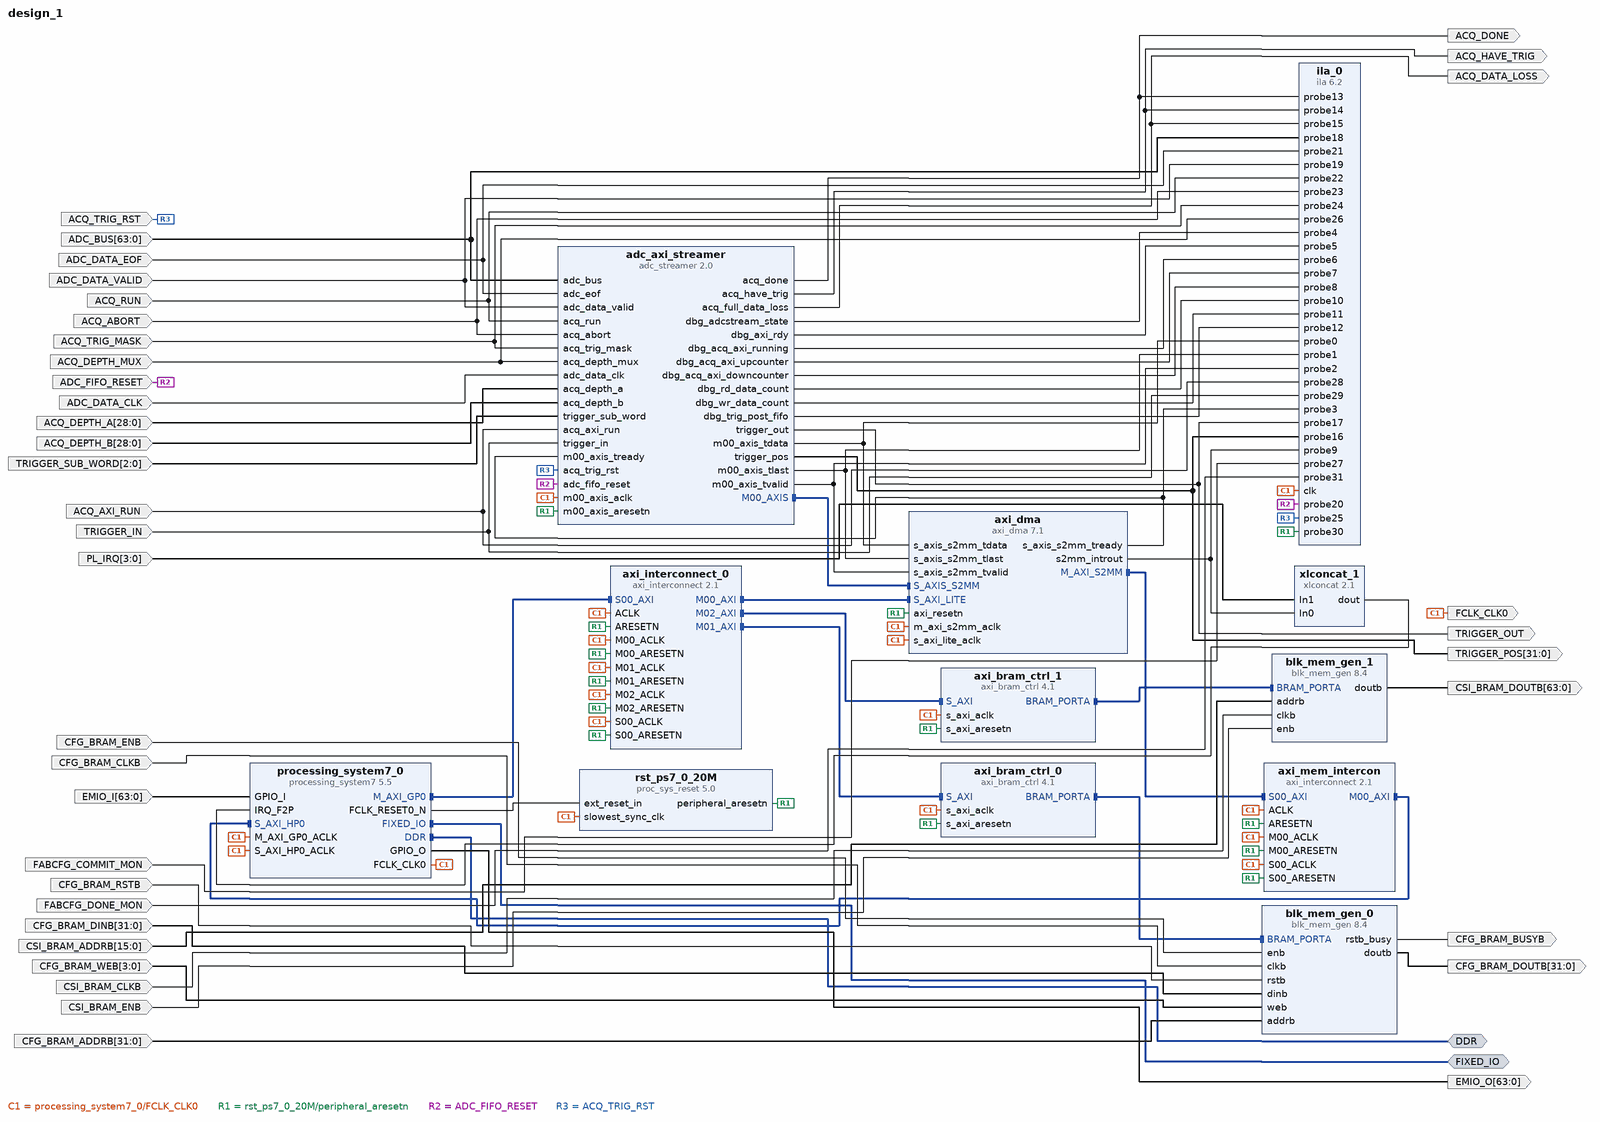
[diagram p0: block diagram of the top level]
# Vivado block design design_1, xc7z014sclg400-1, Vivado 2019.2
create_bd_design design_1

create_bd_intf_port -mode Master -vlnv xilinx.com:interface:ddrx_rtl:1.0 DDR
create_bd_intf_port -mode Master -vlnv xilinx.com:display_processing_system7:fixedio_rtl:1.0 FIXED_IO
create_bd_port -dir O -type clk FCLK_CLK0
create_bd_port -dir I -from 63 -to 0 ADC_BUS
create_bd_port -dir I -type clk ADC_DATA_CLK
set_property -dict {CONFIG.FREQ_HZ 125000000} [get_bd_ports ADC_DATA_CLK]
create_bd_port -dir I -from 63 -to 0 EMIO_I
create_bd_port -dir O -from 63 -to 0 EMIO_O
create_bd_port -dir I ADC_DATA_VALID
create_bd_port -dir I ADC_DATA_EOF
create_bd_port -dir I ADC_FIFO_RESET
create_bd_port -dir I CFG_BRAM_ENB
create_bd_port -dir I CFG_BRAM_CLKB
create_bd_port -dir I CFG_BRAM_RSTB
create_bd_port -dir I -from 31 -to 0 CFG_BRAM_DINB
create_bd_port -dir O -from 31 -to 0 CFG_BRAM_DOUTB
create_bd_port -dir I -from 3 -to 0 CFG_BRAM_WEB
create_bd_port -dir I -from 31 -to 0 CFG_BRAM_ADDRB
create_bd_port -dir O CFG_BRAM_BUSYB
create_bd_port -dir I ACQ_RUN
create_bd_port -dir I ACQ_ABORT
create_bd_port -dir I ACQ_TRIG_MASK
create_bd_port -dir I ACQ_TRIG_RST
create_bd_port -dir I ACQ_DEPTH_MUX
create_bd_port -dir I -from 28 -to 0 ACQ_DEPTH_A
create_bd_port -dir I -from 28 -to 0 ACQ_DEPTH_B
create_bd_port -dir I ACQ_AXI_RUN
create_bd_port -dir I TRIGGER_IN
create_bd_port -dir I -from 2 -to 0 TRIGGER_SUB_WORD
create_bd_port -dir O ACQ_DONE
create_bd_port -dir O ACQ_HAVE_TRIG
create_bd_port -dir O -from 31 -to 0 TRIGGER_POS
create_bd_port -dir O TRIGGER_OUT
create_bd_port -dir O ACQ_DATA_LOSS
create_bd_port -dir I FABCFG_COMMIT_MON
create_bd_port -dir I FABCFG_DONE_MON
create_bd_port -dir I -from 3 -to 0 PL_IRQ
create_bd_port -dir O -from 63 -to 0 CSI_BRAM_DOUTB
create_bd_port -dir I -from 15 -to 0 CSI_BRAM_ADDRB
create_bd_port -dir I -type clk CSI_BRAM_CLKB
set_property -dict {CONFIG.FREQ_HZ 100000000} [get_bd_ports CSI_BRAM_CLKB]
create_bd_port -dir I CSI_BRAM_ENB

create_bd_cell -type ip -vlnv xilinx.com:ip:proc_sys_reset:5.0 rst_ps7_0_20M
create_bd_cell -type ip -vlnv xilinx.com:ip:processing_system7:5.5 processing_system7_0
set_property -dict [list \
  CONFIG.PCW_FPGA0_PERIPHERAL_FREQMHZ 180 \
  CONFIG.PCW_FPGA1_PERIPHERAL_FREQMHZ 150 \
  CONFIG.PCW_GPIO_EMIO_GPIO_ENABLE 1 \
  CONFIG.PCW_GPIO_EMIO_GPIO_IO 64 \
  CONFIG.PCW_GPIO_MIO_GPIO_ENABLE 1 \
  CONFIG.PCW_GPIO_MIO_GPIO_IO MIO \
  CONFIG.PCW_I2C_RESET_ENABLE 0 \
  CONFIG.PCW_IRQ_F2P_INTR 1 \
  CONFIG.PCW_SPI0_PERIPHERAL_ENABLE 1 \
  CONFIG.PCW_SPI0_SPI0_IO EMIO \
  CONFIG.PCW_TTC0_PERIPHERAL_ENABLE 1 \
  CONFIG.PCW_TTC0_TTC0_IO EMIO \
  CONFIG.PCW_UART1_BAUD_RATE 460800 \
  CONFIG.PCW_UART1_PERIPHERAL_ENABLE 1 \
  CONFIG.PCW_UART1_UART1_IO {MIO 48 .. 49} \
  CONFIG.PCW_UART_PERIPHERAL_FREQMHZ 100 \
  CONFIG.PCW_UIPARAM_DDR_BUS_WIDTH {16 Bit} \
  CONFIG.PCW_UIPARAM_DDR_PARTNO {MT41K128M16 JT-125} \
  CONFIG.PCW_USB_RESET_ENABLE 0 \
  CONFIG.PCW_USE_FABRIC_INTERRUPT 1 \
  CONFIG.PCW_USE_S_AXI_HP0 1 \
] [get_bd_cells processing_system7_0]
# 230 more settings of processing_system7_0 are not shown: defaults, MIO pin electricals, DDR timing, and values the tool derives
create_bd_cell -type ip -vlnv xilinx.com:ip:axi_bram_ctrl:4.1 axi_bram_ctrl_0
set_property -dict {CONFIG.DATA_WIDTH 32 CONFIG.PROTOCOL AXI4 CONFIG.SINGLE_PORT_BRAM 1} [get_bd_cells axi_bram_ctrl_0]
create_bd_cell -type ip -vlnv xilinx.com:ip:axi_dma:7.1 axi_dma
set_property -dict [list \
  CONFIG.c_include_mm2s 0 \
  CONFIG.c_include_s2mm 1 \
  CONFIG.c_include_s2mm_dre 1 \
  CONFIG.c_include_sg 0 \
  CONFIG.c_m_axi_s2mm_data_width 64 \
  CONFIG.c_s2mm_burst_size 16 \
  CONFIG.c_sg_length_width 24 \
] [get_bd_cells axi_dma]
create_bd_cell -type ip -vlnv xilinx.com:ip:axi_interconnect:2.1 axi_interconnect_0
set_property -dict {CONFIG.NUM_MI 3} [get_bd_cells axi_interconnect_0]
create_bd_cell -type ip -vlnv xilinx.com:ip:axi_interconnect:2.1 axi_mem_intercon
set_property -dict {CONFIG.ENABLE_ADVANCED_OPTIONS 0 CONFIG.NUM_MI 1 CONFIG.NUM_SI 1} [get_bd_cells axi_mem_intercon]
create_bd_cell -type ip -vlnv xilinx.com:ip:blk_mem_gen:8.4 blk_mem_gen_0
set_property -dict [list \
  CONFIG.EN_SAFETY_CKT true \
  CONFIG.Enable_32bit_Address true \
  CONFIG.Enable_B Use_ENB_Pin \
  CONFIG.Memory_Type True_Dual_Port_RAM \
  CONFIG.Port_B_Clock 100 \
  CONFIG.Port_B_Enable_Rate 100 \
  CONFIG.Port_B_Write_Rate 50 \
  CONFIG.Register_PortA_Output_of_Memory_Primitives false \
  CONFIG.Register_PortB_Output_of_Memory_Primitives false \
  CONFIG.Use_RSTA_Pin true \
  CONFIG.Use_RSTB_Pin true \
  CONFIG.use_bram_block BRAM_Controller \
] [get_bd_cells blk_mem_gen_0]
create_bd_cell -type ip -vlnv xilinx.com:ip:xlconcat:2.1 xlconcat_1
set_property -dict [list \
  CONFIG.IN0_WIDTH 1 \
  CONFIG.IN1_WIDTH 4 \
  CONFIG.IN2_WIDTH 1 \
  CONFIG.IN3_WIDTH 4 \
  CONFIG.NUM_PORTS 2 \
  CONFIG.dout_width 5 \
] [get_bd_cells xlconcat_1]
create_bd_cell -type ip -vlnv xilinx.com:ip:ila:6.2 ila_0
set_property -dict [list \
  CONFIG.C_DATA_DEPTH 4096 \
  CONFIG.C_ENABLE_ILA_AXI_MON false \
  CONFIG.C_MONITOR_TYPE Native \
  CONFIG.C_NUM_OF_PROBES 32 \
  CONFIG.C_PROBE27_WIDTH 1 \
  CONFIG.C_PROBE28_WIDTH 1 \
  CONFIG.C_PROBE36_WIDTH 1 \
  CONFIG.C_PROBE37_WIDTH 1 \
  CONFIG.C_PROBE9_WIDTH 1 \
] [get_bd_cells ila_0]
create_bd_cell -type ip -vlnv xilinx.com:ip:axi_bram_ctrl:4.1 axi_bram_ctrl_1
set_property -dict {CONFIG.DATA_WIDTH 32 CONFIG.SINGLE_PORT_BRAM 1} [get_bd_cells axi_bram_ctrl_1]
create_bd_cell -type ip -vlnv xilinx.com:ip:blk_mem_gen:8.4 blk_mem_gen_1
set_property -dict [list \
  CONFIG.Enable_32bit_Address false \
  CONFIG.Enable_B Use_ENB_Pin \
  CONFIG.Memory_Type True_Dual_Port_RAM \
  CONFIG.Operating_Mode_A NO_CHANGE \
  CONFIG.Operating_Mode_B WRITE_FIRST \
  CONFIG.Port_B_Clock 100 \
  CONFIG.Port_B_Enable_Rate 100 \
  CONFIG.Port_B_Write_Rate 50 \
  CONFIG.Read_Width_A 32 \
  CONFIG.Read_Width_B 64 \
  CONFIG.Register_PortA_Output_of_Memory_Primitives true \
  CONFIG.Register_PortB_Output_of_Memory_Primitives true \
  CONFIG.Use_Byte_Write_Enable false \
  CONFIG.Use_RSTA_Pin false \
  CONFIG.Write_Depth_A 32768 \
  CONFIG.Write_Width_B 64 \
  CONFIG.use_bram_block Stand_Alone \
] [get_bd_cells blk_mem_gen_1]
create_bd_cell -type ip -vlnv xilinx.com:user:adc_streamer:2.0 adc_axi_streamer

# ---- connections ----

connect_bd_intf_net [get_bd_intf_pins axi_interconnect_0/M02_AXI] [get_bd_intf_pins axi_bram_ctrl_1/S_AXI]
connect_bd_intf_net [get_bd_intf_pins axi_bram_ctrl_1/BRAM_PORTA] [get_bd_intf_pins blk_mem_gen_1/BRAM_PORTA]
connect_bd_intf_net [get_bd_intf_pins adc_axi_streamer/M00_AXIS] [get_bd_intf_pins axi_dma/S_AXIS_S2MM]
connect_bd_intf_net [get_bd_intf_ports FIXED_IO] [get_bd_intf_pins processing_system7_0/FIXED_IO]
connect_bd_intf_net [get_bd_intf_pins axi_dma/M_AXI_S2MM] [get_bd_intf_pins axi_mem_intercon/S00_AXI]
connect_bd_intf_net [get_bd_intf_ports DDR] [get_bd_intf_pins processing_system7_0/DDR]
connect_bd_intf_net [get_bd_intf_pins axi_interconnect_0/M01_AXI] [get_bd_intf_pins axi_bram_ctrl_0/S_AXI]
connect_bd_intf_net [get_bd_intf_pins processing_system7_0/S_AXI_HP0] [get_bd_intf_pins axi_mem_intercon/M00_AXI]
connect_bd_intf_net [get_bd_intf_pins blk_mem_gen_0/BRAM_PORTA] [get_bd_intf_pins axi_bram_ctrl_0/BRAM_PORTA]
connect_bd_intf_net [get_bd_intf_pins axi_dma/S_AXI_LITE] [get_bd_intf_pins axi_interconnect_0/M00_AXI]
connect_bd_intf_net [get_bd_intf_pins axi_interconnect_0/S00_AXI] [get_bd_intf_pins processing_system7_0/M_AXI_GP0]
connect_bd_net [get_bd_pins processing_system7_0/FCLK_CLK0] \
  [get_bd_ports FCLK_CLK0] [get_bd_pins rst_ps7_0_20M/slowest_sync_clk] [get_bd_pins processing_system7_0/S_AXI_HP0_ACLK] \
  [get_bd_pins axi_bram_ctrl_0/s_axi_aclk] [get_bd_pins axi_dma/s_axi_lite_aclk] [get_bd_pins axi_dma/m_axi_s2mm_aclk] \
  [get_bd_pins axi_interconnect_0/ACLK] [get_bd_pins axi_interconnect_0/S00_ACLK] [get_bd_pins axi_interconnect_0/M00_ACLK] \
  [get_bd_pins axi_mem_intercon/ACLK] [get_bd_pins axi_mem_intercon/S00_ACLK] [get_bd_pins axi_mem_intercon/M00_ACLK] \
  [get_bd_pins ila_0/clk] [get_bd_pins axi_bram_ctrl_1/s_axi_aclk] [get_bd_pins processing_system7_0/M_AXI_GP0_ACLK] \
  [get_bd_pins axi_interconnect_0/M01_ACLK] [get_bd_pins axi_interconnect_0/M02_ACLK] \
  [get_bd_pins adc_axi_streamer/m00_axis_aclk]
connect_bd_net [get_bd_ports ADC_BUS] [get_bd_pins ila_0/probe18] [get_bd_pins adc_axi_streamer/adc_bus]
connect_bd_net [get_bd_pins rst_ps7_0_20M/peripheral_aresetn] \
  [get_bd_pins axi_bram_ctrl_0/s_axi_aresetn] [get_bd_pins axi_dma/axi_resetn] [get_bd_pins axi_interconnect_0/ARESETN] \
  [get_bd_pins axi_interconnect_0/S00_ARESETN] [get_bd_pins axi_interconnect_0/M00_ARESETN] \
  [get_bd_pins axi_mem_intercon/ARESETN] [get_bd_pins axi_mem_intercon/S00_ARESETN] \
  [get_bd_pins axi_mem_intercon/M00_ARESETN] [get_bd_pins axi_bram_ctrl_1/s_axi_aresetn] \
  [get_bd_pins axi_interconnect_0/M01_ARESETN] [get_bd_pins axi_interconnect_0/M02_ARESETN] [get_bd_pins ila_0/probe30] \
  [get_bd_pins adc_axi_streamer/m00_axis_aresetn]
connect_bd_net [get_bd_pins processing_system7_0/FCLK_RESET0_N] [get_bd_pins rst_ps7_0_20M/ext_reset_in]
connect_bd_net [get_bd_ports EMIO_I] [get_bd_pins processing_system7_0/GPIO_I]
connect_bd_net [get_bd_pins processing_system7_0/GPIO_O] [get_bd_ports EMIO_O]
connect_bd_net [get_bd_pins xlconcat_1/dout] [get_bd_pins processing_system7_0/IRQ_F2P]
connect_bd_net [get_bd_pins axi_dma/s2mm_introut] [get_bd_pins xlconcat_1/In0] [get_bd_pins ila_0/probe9]
connect_bd_net [get_bd_ports ADC_DATA_CLK] [get_bd_pins adc_axi_streamer/adc_data_clk]
connect_bd_net [get_bd_ports ADC_DATA_EOF] [get_bd_pins ila_0/probe21] [get_bd_pins adc_axi_streamer/adc_eof]
connect_bd_net [get_bd_ports ADC_FIFO_RESET] [get_bd_pins ila_0/probe20] [get_bd_pins adc_axi_streamer/adc_fifo_reset]
connect_bd_net [get_bd_ports ADC_DATA_VALID] [get_bd_pins ila_0/probe19] [get_bd_pins adc_axi_streamer/adc_data_valid]
connect_bd_net -net CFG_BRAM_WREN_1 [get_bd_ports CFG_BRAM_ENB] [get_bd_pins blk_mem_gen_0/enb]
connect_bd_net [get_bd_ports CFG_BRAM_CLKB] [get_bd_pins blk_mem_gen_0/clkb]
connect_bd_net [get_bd_ports CFG_BRAM_RSTB] [get_bd_pins blk_mem_gen_0/rstb]
connect_bd_net [get_bd_ports CFG_BRAM_DINB] [get_bd_pins blk_mem_gen_0/dinb]
connect_bd_net [get_bd_pins blk_mem_gen_0/doutb] [get_bd_ports CFG_BRAM_DOUTB]
connect_bd_net [get_bd_ports CFG_BRAM_WEB] [get_bd_pins blk_mem_gen_0/web]
connect_bd_net -net CFG_BRAM_ADDR_1 [get_bd_ports CFG_BRAM_ADDRB] [get_bd_pins blk_mem_gen_0/addrb]
connect_bd_net [get_bd_pins blk_mem_gen_0/rstb_busy] [get_bd_ports CFG_BRAM_BUSYB]
connect_bd_net [get_bd_ports ACQ_RUN] [get_bd_pins ila_0/probe22] [get_bd_pins adc_axi_streamer/acq_run]
connect_bd_net [get_bd_ports ACQ_ABORT] [get_bd_pins ila_0/probe23] [get_bd_pins adc_axi_streamer/acq_abort]
connect_bd_net [get_bd_ports ACQ_TRIG_MASK] [get_bd_pins ila_0/probe24] [get_bd_pins adc_axi_streamer/acq_trig_mask]
connect_bd_net [get_bd_ports ACQ_TRIG_RST] [get_bd_pins ila_0/probe25] [get_bd_pins adc_axi_streamer/acq_trig_rst]
connect_bd_net [get_bd_ports ACQ_DEPTH_MUX] [get_bd_pins ila_0/probe26] [get_bd_pins adc_axi_streamer/acq_depth_mux]
connect_bd_net [get_bd_ports ACQ_DEPTH_A] [get_bd_pins adc_axi_streamer/acq_depth_a]
connect_bd_net [get_bd_ports ACQ_DEPTH_B] [get_bd_pins adc_axi_streamer/acq_depth_b]
connect_bd_net [get_bd_ports ACQ_AXI_RUN] [get_bd_pins ila_0/probe28] [get_bd_pins adc_axi_streamer/acq_axi_run]
connect_bd_net -net ACQ_TRIGGER_IN_1 [get_bd_ports TRIGGER_IN] [get_bd_pins ila_0/probe29] [get_bd_pins adc_axi_streamer/trigger_in]
connect_bd_net -net ACQ_TRIG_WORD_1 [get_bd_ports TRIGGER_SUB_WORD] [get_bd_pins adc_axi_streamer/trigger_sub_word]
connect_bd_net [get_bd_pins adc_axi_streamer/acq_done] [get_bd_ports ACQ_DONE] [get_bd_pins ila_0/probe13]
connect_bd_net [get_bd_pins adc_axi_streamer/acq_have_trig] [get_bd_ports ACQ_HAVE_TRIG] [get_bd_pins ila_0/probe14]
connect_bd_net [get_bd_pins adc_axi_streamer/trigger_pos] [get_bd_ports TRIGGER_POS] [get_bd_pins ila_0/probe16]
connect_bd_net [get_bd_pins adc_axi_streamer/trigger_out] [get_bd_ports TRIGGER_OUT] [get_bd_pins ila_0/probe17]
connect_bd_net [get_bd_pins axi_dma/s_axis_s2mm_tready] [get_bd_pins ila_0/probe3] [get_bd_pins adc_axi_streamer/m00_axis_tready]
connect_bd_net [get_bd_pins adc_axi_streamer/m00_axis_tdata] [get_bd_pins axi_dma/s_axis_s2mm_tdata] [get_bd_pins ila_0/probe0]
connect_bd_net [get_bd_pins adc_axi_streamer/m00_axis_tlast] [get_bd_pins axi_dma/s_axis_s2mm_tlast] [get_bd_pins ila_0/probe1]
connect_bd_net [get_bd_pins adc_axi_streamer/m00_axis_tvalid] [get_bd_pins axi_dma/s_axis_s2mm_tvalid] [get_bd_pins ila_0/probe2]
connect_bd_net -net adc_axi_streamer_adc_fifo_full [get_bd_pins adc_axi_streamer/acq_full_data_loss] \
  [get_bd_ports ACQ_DATA_LOSS] [get_bd_pins ila_0/probe15]
connect_bd_net [get_bd_pins adc_axi_streamer/dbg_adcstream_state] [get_bd_pins ila_0/probe4]
connect_bd_net [get_bd_pins adc_axi_streamer/dbg_axi_rdy] [get_bd_pins ila_0/probe5]
connect_bd_net [get_bd_pins adc_axi_streamer/dbg_acq_axi_running] [get_bd_pins ila_0/probe6]
connect_bd_net [get_bd_pins adc_axi_streamer/dbg_acq_axi_upcounter] [get_bd_pins ila_0/probe7]
connect_bd_net [get_bd_pins adc_axi_streamer/dbg_acq_axi_downcounter] [get_bd_pins ila_0/probe8]
connect_bd_net [get_bd_pins adc_axi_streamer/dbg_rd_data_count] [get_bd_pins ila_0/probe10]
connect_bd_net [get_bd_pins adc_axi_streamer/dbg_wr_data_count] [get_bd_pins ila_0/probe11]
connect_bd_net [get_bd_pins adc_axi_streamer/dbg_trig_post_fifo] [get_bd_pins ila_0/probe12]
connect_bd_net [get_bd_ports FABCFG_COMMIT_MON] [get_bd_pins ila_0/probe27]
connect_bd_net [get_bd_ports FABCFG_DONE_MON] [get_bd_pins ila_0/probe31]
connect_bd_net [get_bd_pins blk_mem_gen_1/doutb] [get_bd_ports CSI_BRAM_DOUTB]
connect_bd_net [get_bd_ports CSI_BRAM_ADDRB] [get_bd_pins blk_mem_gen_1/addrb]
connect_bd_net [get_bd_ports CSI_BRAM_CLKB] [get_bd_pins blk_mem_gen_1/clkb]
connect_bd_net [get_bd_ports CSI_BRAM_ENB] [get_bd_pins blk_mem_gen_1/enb]
connect_bd_net [get_bd_ports PL_IRQ] [get_bd_pins xlconcat_1/In1]
set_property HDL_ATTRIBUTE.BMM_INFO_PROCESSOR {arm > design_1 axi_bram_ctrl_0 design_1 axi_bram_ctrl_1} [get_bd_cells processing_system7_0]
set_property HDL_ATTRIBUTE.KEEP_HIERARCHY yes [get_bd_cells processing_system7_0]
set_property HDL_ATTRIBUTE.BMM_INFO_ADDRESS_SPACE {byte  0x40000000 32 > design_1 blk_mem_gen_0} [get_bd_cells axi_bram_ctrl_0]
set_property HDL_ATTRIBUTE.KEEP_HIERARCHY yes [get_bd_cells axi_bram_ctrl_0]
set_property HDL_ATTRIBUTE.BMM_INFO_ADDRESS_SPACE {byte  0x42000000 32 > design_1 blk_mem_gen_1} [get_bd_cells axi_bram_ctrl_1]
set_property HDL_ATTRIBUTE.KEEP_HIERARCHY yes [get_bd_cells axi_bram_ctrl_1]

# ---- address map ----
assign_bd_address -offset 0x00000000 -range 512M -target_address_space [get_bd_addr_spaces axi_dma/Data_S2MM] [get_bd_addr_segs processing_system7_0/S_AXI_HP0/HP0_DDR_LOWOCM]
assign_bd_address -offset 0x40000000 -range 8K -target_address_space [get_bd_addr_spaces processing_system7_0/Data] [get_bd_addr_segs axi_bram_ctrl_0/S_AXI/Mem0]
assign_bd_address -offset 0x40400000 -range 64K -target_address_space [get_bd_addr_spaces processing_system7_0/Data] [get_bd_addr_segs axi_dma/S_AXI_LITE/Reg]
assign_bd_address -offset 0x42000000 -range 64K -target_address_space [get_bd_addr_spaces processing_system7_0/Data] [get_bd_addr_segs axi_bram_ctrl_1/S_AXI/Mem0]

set_property USER_COMMENTS.comment_1 {AXI BRAM Controller for Fabric Configuration} [get_bd_cells /axi_bram_ctrl_0]
set_property USER_COMMENTS.comment_0 {BRAM for Fabric Configuration} [get_bd_cells /blk_mem_gen_0]
set_property USER_COMMENTS.comment_4 {CSI Output BRAM} [get_bd_cells /blk_mem_gen_1]

validate_bd_design
save_bd_design
